# Altium schematic sheet Extension board.SchDoc
size A4
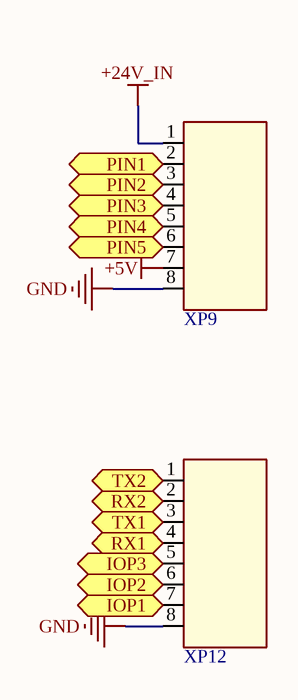
[diagram p0: Extension board.SchDoc]

## Parts
XP9  CON_8  [HEAD-1/8/2.54]  (value not drawn)
XP12  CON_8  [HEAD-1/8/2.54]  (value not drawn)

## Ports
IOP1, IOP2, IOP3, PIN1, PIN2, PIN3, PIN4, PIN5, RX1 (out), RX2 (out), TX1 (in), TX2 (in)

## Nets
+5V: XP9.7
+24V_IN: XP9.1
GND: XP9.8 XP12.8
IOP1: XP12.7 ; port IOP1
IOP2: XP12.6 ; port IOP2
IOP3: XP12.5 ; port IOP3
PIN1: XP9.2 ; port PIN1
PIN2: XP9.3 ; port PIN2
PIN3: XP9.4 ; port PIN3
PIN4: XP9.5 ; port PIN4
PIN5: XP9.6 ; port PIN5
RX1: XP12.4 ; port RX1
RX2: XP12.2 ; port RX2
TX1: XP12.3 ; port TX1
TX2: XP12.1 ; port TX2